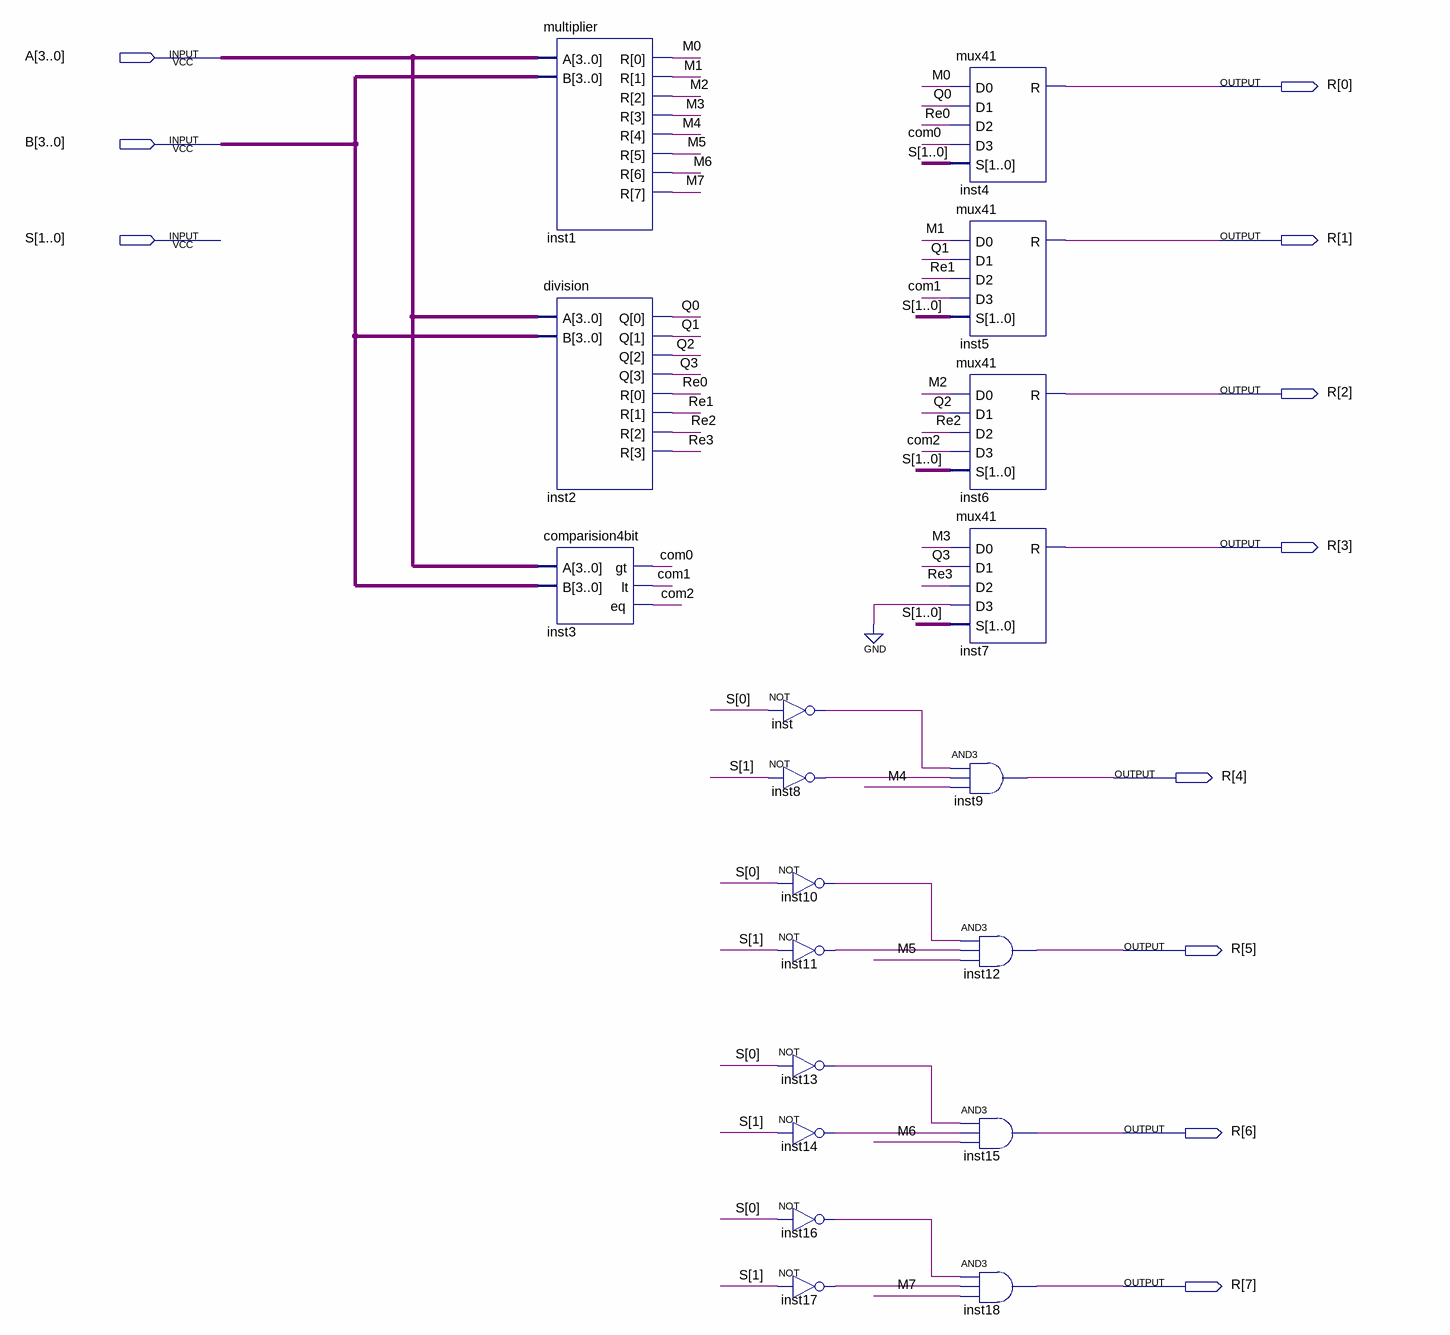
[diagram p0: schematic sheet]
// Quartus schematic ALUMoreFunc.bdf as structural Verilog: 19 symbols, 11 pins
module ALUMoreFunc (
  input  [3:0] A,
  input  [3:0] B,
  input  [1:0] S,
  output [7:0] R
);

  wire com0, com1, com2, inst8_out, inst10_out, inst11_out, inst13_out, inst14_out, inst16_out, inst17_out,
       inst_out, M0, M1, M2, M3, M4, M5, M6, M7, Q0, Q1, Q2, Q3, Re0, Re1, Re2, Re3;

  multiplier inst1 (.A(A), .B(B), .R({M7, M6, M5, M4, M3, M2, M1, M0}));
  division inst2 (.A(A), .B(B), .Q({Q3, Q2, Q1, Q0}), .R({Re3, Re2, Re1, Re0}));
  comparision4bit inst3 (.A(A), .B(B), .gt(com0), .lt(com1), .eq(com2));
  not inst (inst_out, S[0]);
  not inst8 (inst8_out, S[1]);
  not inst10 (inst10_out, S[0]);
  not inst11 (inst11_out, S[1]);
  not inst13 (inst13_out, S[0]);
  not inst14 (inst14_out, S[1]);
  not inst16 (inst16_out, S[0]);
  not inst17 (inst17_out, S[1]);
  mux41 inst4 (.D0(M0), .D1(Q0), .D2(Re0), .D3(com0), .S(S), .R(R[0]));
  mux41 inst5 (.D0(M1), .D1(Q1), .D2(Re1), .D3(com1), .S(S), .R(R[1]));
  mux41 inst6 (.D0(M2), .D1(Q2), .D2(Re2), .D3(com2), .S(S), .R(R[2]));
  mux41 inst7 (.D0(M3), .D1(Q3), .D2(Re3), .D3(1'b0), .S(S), .R(R[3]));
  and inst9 (R[4], inst_out, inst8_out, M4);
  and inst12 (R[5], inst10_out, inst11_out, M5);
  and inst15 (R[6], inst13_out, inst14_out, M6);
  and inst18 (R[7], inst16_out, inst17_out, M7);
endmodule
